# Altium schematic sheet CAN.SchDoc
size A; SheetNumber: 7; SheetTotal: 8
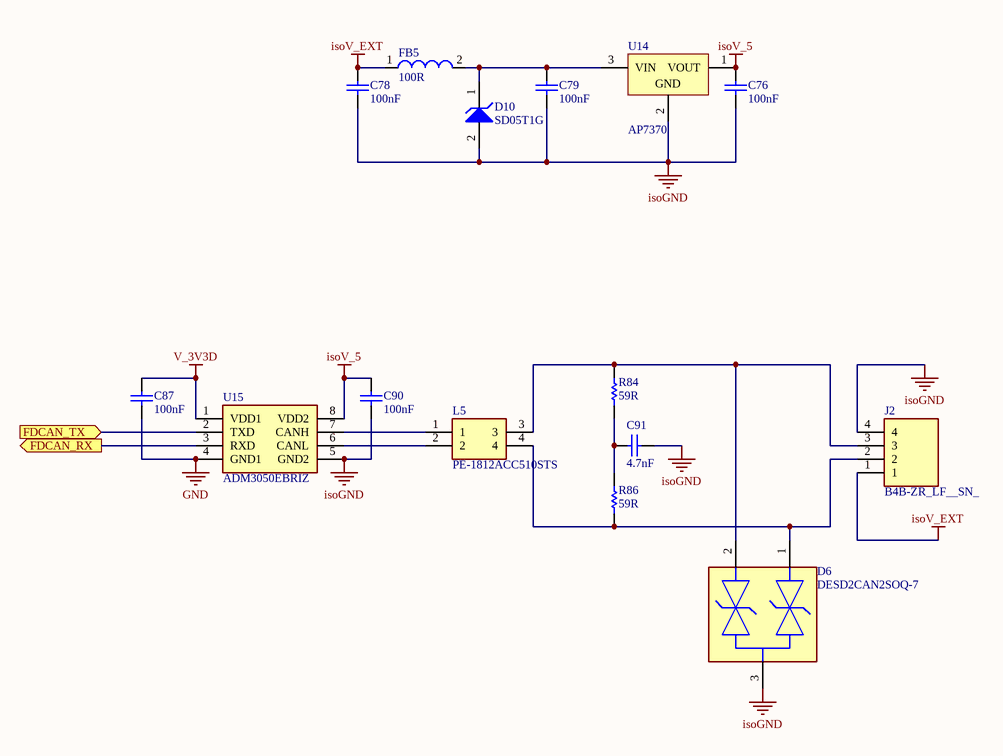
[diagram p0: CAN.SchDoc]

## Parts
C76  100nF  [CAPC1608X90X35NL10T15]
C78  100nF  [CAPC1608X90X35NL10T15]
C79  100nF  [CAPC1608X90X35NL10T15]
C87  100nF  [CAPC1608X90X35NL10T15]
C90  100nF  [CAPC1608X90X35NL10T15]
C91  4.7nF  [CAPC1608X90X35ML10T15]
D6  DESD2CAN2SOQ-7  [FP-SOT23-MFG]
D10  SD05T1G  [ONSC-SOD-323-2-477-02_G_V]
FB5  100R  [SMD-0603]
J2  B4B-ZR_LF__SN_  [SHDR4W50P0X150_1X4_750X350X450P]
L5  PE-1812ACC510STS  [PE1812ACC510STS]
R84  59R  [RESC1608X55X30ML15T15]
R86  59R  [RESC1608X55X30ML15T15]
U14  AP7370  [SOT-89_L]
U15  ADM3050EBRIZ  [SOIC127P1031X265-8N]

## Ports
FDCAN_RX (out), FDCAN_TX (in)

## Nets
GND: C87.1 U15.4(GND1)
isoGND: C76.1 C78.1 C79.1 C90.1 C91.2 D6.3 D10.2(A) J2.4 U14.2(GND) U15.5(GND2)
isoV_5: C76.2 C90.2 U14.1(VOUT) U15.8(VDD2)
isoV_EXT: C78.2 FB5.1 J2.1
V_3V3D: C87.2 U15.1(VDD1)
FDCAN_RX: U15.3(RXD) ; port FDCAN_RX
FDCAN_TX: U15.2(TXD) ; port FDCAN_TX
NetC79_2: C79.2 D10.1(K) FB5.2 U14.3(VIN)
NetC91_1: C91.1 R84.1 R86.2
NetD6_1: D6.1 J2.2 L5.4 R86.1
NetD6_2: D6.2 J2.3 L5.3 R84.2
NetL5_1: L5.1 U15.7(CANH)
NetL5_2: L5.2 U15.6(CANL)

## Library data of the parts
C76 C78 C79 C87 C90 = CAP: X7R 100nF ±10% 50V 0603 Multilayer Ceramic Capacitors MLCC - SMD/SMT ROHS; Part Number: GCM188R72A104KA64D; Manufacturer: Murata; Manufacturer Part Number: CC0603KRX7R9BB104; Voltage Rating: 100V; Supplier 1: Arrow Electronics; Supplier Part Number 1: GCM188R72A104KA64D; RoHS: Yes; Category: Ceramic Capacitors; Mount: Surface Mount; Case/Package: 0603; Case Code (Imperial): 0603; Case Code (Metric): 1608; Min Operating Temperature: -55°C; Max Operating Temperature: 125°C; Tolerance: 10%; Packaging: Tape and Reel; Capacitance: 100nF; Dielectric: X7R; Termination: SMD/SMT; Voltage Rating (DC): 100V; Length: 1.6mm; Height: 0.8mm; Depth: 0.8mm; Radiation Hardening: No; ComponentLink1URL: https://datasheet.ciiva.com/17451/product-17451047.pdf?src-supplier=Avnet+Europe; ComponentLink1Description: https://datasheet.ciiva.com/17451/product-17451047.pdf?src-supplier=Avnet+Europe; ComponentLink2URL: https://datasheet.ciiva.com/26889/getdatasheetpartid-387765-26889164.pdf?src-supplier=Verical; ComponentLink2Description: https://datasheet.ciiva.com/26889/getdatasheetpartid-387765-26889164.pdf?src-supplier=Verical; Parameter 1: *; JLCPCB Part #: C14663
C91 = CMP-2006-02924-1: X7R ±10% 4.7nF 50V 0603 Multilayer Ceramic Capacitors MLCC - SMD/SMT ROHS; Part Number: GRM188R71H472KA01D; Manufacturer: Murata; Insulation Resistance: 10GR; Supplier 1: Farnell; Supplier Part Number 1: 1118177; Manufacturer Part Number: GRM188R71H472KA01D; RoHS: Yes; Category: Ceramic Capacitors; Pricing 1: 1=19.92000, 3=19.13000 (GBP); Mount: Surface Mount; Case/Package: 0603; Number of Pins: 2; Case Code (Imperial): 0603; Case Code (Metric): 1608; Dielectric Material: Ceramic; Material: Ceramic; Min Operating Temperature: -55°C; Max Operating Temperature: 125°C; Capacitance: 4.7nF; Voltage Rating (DC): 50V; Tolerance: 10%; Packaging: Tape and Reel; Dielectric: X7R; Series: GRM; Voltage Rating: 50V; Package Quantity: 1; Termination: SMD/SMT; Voltage: 50V; Length: 1.6mm; Width: 0.8mm; Height: 0.8mm; Depth: 0.8mm; Thickness: 0.035inch; Radiation Hardening: No; RoHS Compliant: Yes; REACH SVHC: No SVHC; Lead Free: Lead Free; ComponentLink1URL: https://datasheet.ciiva.com/5412/product-5412608.pdf?src-supplier=Mouser; ComponentLink1Description: https://datasheet.ciiva.com/5412/product-5412608.pdf?src-supplier=Mouser; ComponentLink2URL: https://datasheet.ciiva.com/18102/getdatasheetpartid-75298-18102657.pdf?src-supplier=Verical; ComponentLink2Description: https://datasheet.ciiva.com/18102/getdatasheetpartid-75298-18102657.pdf?src-supplier=Verical; ComponentLink3URL: https://datasheet.ciiva.com/11787/0900766b8003061f-11787116.pdf?src-supplier=RSComponents; ComponentLink3Description: https://datasheet.ciiva.com/11787/0900766b8003061f-11787116.pdf?src-supplier=RSComponents; ComponentLink4URL: https://datasheet.ciiva.com/29201/451888-da-01-en-vs-kondensator-0603-29201828.pdf?src-supplier=Conrad; ComponentLink4Description: https://datasheet.ciiva.com/29201/451888-da-01-en-vs-kondensator-0603-29201828.pdf?src-supplier=Conrad; ComponentLink5URL: https://datasheet.ciiva.com/7937/4360-7937669.pdf?src-supplier=Element14; ComponentLink5Description: https://datasheet.ciiva.com/7937/4360-7937669.pdf?src-supplier=Element14; ComponentLink6URL: https://datasheet.ciiva.com/48428/nmgrm-data-en-48428597.pdf?src-supplier=Distrelec; ComponentLink6Description: https://datasheet.ciiva.com/48428/nmgrm-data-en-48428597.pdf?src-supplier=Distrelec; ComponentLink7URL: https://datasheet.ciiva.com/7937/4360-7937670.pdf?src-supplier=Element14; ComponentLink7Description: https://datasheet.ciiva.com/7937/4360-7937670.pdf?src-supplier=Element14; ComponentLink8URL: https://datasheet.ciiva.com/7937/4360-7937671.pdf?src-supplier=Element14; ComponentLink8Description: https://datasheet.ciiva.com/7937/4360-7937671.pdf?src-supplier=Element14; ComponentLink9URL: https://datasheet.ciiva.com/130/partnumbering-e-01-130733.pdf?src-supplier=Digi-Key; ComponentLink9Description: https://datasheet.ciiva.com/130/partnumbering-e-01-130733.pdf?src-supplier=Digi-Key; ComponentLink10URL: https://datasheet.ciiva.com/130/partnumbering-e-01-130734.pdf?src-supplier=Digi-Key; ComponentLink10Description: https://datasheet.ciiva.com/130/partnumbering-e-01-130734.pdf?src-supplier=Digi-Key; ComponentLink11URL: https://datasheet.ciiva.com/130/partnumbering-e-01-130735.pdf?src-supplier=Digi-Key; ComponentLink11Description: https://datasheet.ciiva.com/130/partnumbering-e-01-130735.pdf?src-supplier=Digi-Key; Parameter 1: *; JLCPCB Part #: C53987
D6 = CMP-12828-000016-1: TVS DIODE 24V 41V SOT23; Manufacturer: Diodes Inc.; Peak Pulse Current: 5A; Automotive Grade: Grade 0; Value: 25pF; Number Of Channels: 2; Direction: Bidirectional; Max Junction Temp: +150°C; Breakdown Voltage: 25.4V; Peak Pulse Power: 230W; Standoff Height: 0.013mm; ComponentLink2Description: Datasheet; Temperature Range High: +150°C; Device Class L2: TVS Diodes; Octopart: https://octopart.com/desd2can2soq-7-diodes+inc.-53081564; Device Class L3: unset; RoHS: TRUE; ComponentLink2URL: https://www.diodes.com/assets/Datasheets/DESD2CAN2SOQ.pdf; Height: 1.1mm; Digikey Description: TVS DIODE 24V 41V SOT23; Footprint Url: https://www.diodes.com/assets/Package-Files/SOT23.pdf; Manufacturer Part Number: DESD2CAN2SOQ-7; Package: SOT23; Temperature: -65°C to +150°C; Mouser Description: ESD Suppressors / TVS Diodes Dual CAN Bus ESD 25pF 24V 25.4V; Capacitance: 25pF; Category: Diode; Clamping Voltage: 41V; Lead Free: Yes; Reverse Standoff Voltage: 24V; Device Class L1: Circuit Protection; Temperature Range Low: -65°C; Automotive: Yes; Parameter 1: *; JLCPCB Part #: *
D10 = CMP-1061-00629-1: Transient Voltage Suppressor Diode, for ESD Protection, 2-Pin SOD-323, Pb-Free, Tape and Reel; Manufacturer: On Semiconductor; PPK Max (W): 350; IR Max (uA): 10; Direction: Unidirectional; ComponentLink1Description: Manufacturer URL; PackageReference: SOD-323-2-477-02_G; Mounting Technology: Surface Mount; PackageVersion: Rev. G, 02/2005; ComponentLink2URL: http://www.onsemi.com/pub_link/Collateral/SD05T1-D.PDF; PackageDescription: 2-Pin SOD, Body 1.7 x 1.25 mm; Packing: Tape and Reel; ComponentLink2Description: Datasheet; ComponentLink1URL: http://www.onsemi.com/; ComponentLink3Description: Package Specification; ComponentLink3URL: http://www.onsemi.com/pub_link/Collateral/SD05T1-D.PDF; PartNumber: SD05T1G; RoHS: Pb-Free; DatasheetVersion: Rev. 2; Parameter 1: *; JLCPCB Part #: *
FB5 = CMP-0220-00115-1: SMD EMI Suppression Ferrite Bead WE-CBF, Z = 1500 Ohm; DatasheetVersion: Dec-2005; ComponentLink1URL: http://www.we-online.com; PackageVersion: 2009; PackageDescription: Chip Inductor, 2-Leads, Body 1.6 x 0.8 mm; ComponentLink2URL: http://www.we-online.de/katalog/media/pdf/742792691.pdf; ComponentLink1Description: Manufacturer Link; ComponentLink2Description: Datasheet; Impedance: 1500 Ohm; PackageReference: SMD-0603; Parameter 1: *; JLCPCB Part #: *
J2 = B4B-ZR_LF__SN_: Connector; Manufacturer_Name: JST (JAPAN SOLDERLESS TERMINALS); Manufacturer_Part_Number: B4B-ZR(LF)(SN); Datasheet Link: http://docs-emea.rs-online.com/webdocs/1147/0900766b81147f94.pdf; Height: 4.5mm; Arrow Part Number: B4B-ZR(LF)(SN); Arrow Price/Stock: https://www.arrow.com/en/products/b4b-zr-lf-sn/jst-manufacturing; Parameter 1: *; JLCPCB Part #: *
L5 = PE-1812ACC510STS: Inductor; Manufacturer_Name: Pulse; Datasheet Link: https://productfinder.pulseeng.com/doc_type/WEB301/doc_num/W717/doc_part/W717.pdf; Height: 3mm; Manufacturer_Part_Number: PE-1812ACC510STS; Mouser Part Number: 673-PE-1812ACC510STS; Mouser Price/Stock: https://www.mouser.co.uk/ProductDetail/Pulse-Electronics/PE-1812ACC510STS?qs=ar8LaIfZsbGrh9tcPYNGNA%3D%3D; Arrow Part Number: PE-1812ACC510STS; Arrow Price/Stock: https://www.arrow.com/en/products/pe-1812acc510sts/pulse-electronics-corporation; Parameter 1: *; JLCPCB Part #: *
R84 R86 = CMP-2000-00583-1: Manufacturer: Panasonic; Part Number: ERJ-3EKF59R0V; Power Rating: 100mW; Tolerance: 1%; Temperature Coefficient: 100ppm/°C; Voltage Rating: 75V; Voltage Rating (DC): 50V; Supplier 1: Digi-Key; Supplier Part Number 1: P59.0HCT-ND; Manufacturer Part Number: ERJ-3EKF59R0V; RoHS: Yes; Category: Chip SMD Resistors; Stock 1: 12961; Pricing 1: 1=0.10000, 10=0.03700, 100=0.01490, 1000=0.00670, 2500=0.00582 (USD); Mount: Surface Mount; Case/Package: 0603; Case Code (Metric): 1608; Case Code (Imperial): 0603; Contact Plating: Tin; Min Operating Temperature: -55°C; Max Operating Temperature: 155°C; Resistance: 59R; Packaging: Tape and Reel; Resistor Type: Thick Film; Number of Terminations: 2; Package Quantity: 1; Max Power Dissipation: 100mW; Series: ERJ; Termination: SMD/SMT; Resistance Tolerance: 1%; Features: Automotive AEC-Q200; Technology: THICK FILM; Construction: Rectangular; Length: 1.6mm; Width: 0.031inch; Height: 0.45mm; Depth: 0.8mm; RoHS Compliant: Yes; REACH SVHC: Yes; Lead Free: Contains Lead; Military Standard: Not; ComponentLink1URL: https://datasheet.ciiva.com/9188/aoa0000ce2-9188485.pdf?src-supplier=Avnet; ComponentLink1Description: https://datasheet.ciiva.com/9188/aoa0000ce2-9188485.pdf?src-supplier=Avnet; ComponentLink2URL: https://datasheet.ciiva.com/46420/1678782-46420341.pdf?src-supplier=Element14; ComponentLink2Description: https://datasheet.ciiva.com/46420/1678782-46420341.pdf?src-supplier=Element14; ComponentLink3URL: https://datasheet.ciiva.com/22729/1678782-22729158.pdf?src-supplier=Farnell; ComponentLink3Description: https://datasheet.ciiva.com/22729/1678782-22729158.pdf?src-supplier=Farnell; ComponentLink4URL: https://datasheet.ciiva.com/22673/1678782-22673800.pdf?src-supplier=Element14; ComponentLink4Description: https://datasheet.ciiva.com/22673/1678782-22673800.pdf?src-supplier=Element14; ComponentLink5URL: https://datasheet.ciiva.com/9188/aoa0000ce2-9188489.pdf?src-supplier=Avnet; ComponentLink5Description: https://datasheet.ciiva.com/9188/aoa0000ce2-9188489.pdf?src-supplier=Avnet; ComponentLink6URL: https://datasheet.ciiva.com/30242/aoa0000ce2-30242153.pdf?src-supplier=Onlinecomponents.com; ComponentLink6Description: https://datasheet.ciiva.com/30242/aoa0000ce2-30242153.pdf?src-supplier=Onlinecomponents.com; ComponentLink7URL: https://datasheet.ciiva.com/16777/70260748-16777979.pdf?src-supplier=Allied+Electronics; ComponentLink7Description: https://datasheet.ciiva.com/16777/70260748-16777979.pdf?src-supplier=Allied+Electronics; Parameter 1: *; JLCPCB Part #: *
U14 = CMP-0244-00401-1: Ultra Low Drop Voltage Regulators with Inhibit, Low ESR Output Capacitors Compatible, 3.3V, 3-Pin SOT-89, Tape and Reel; ComponentLink1Description: Manufacturer URL; ComponentLink2URL: http://www.st.com/internet/com/TECHNICAL_RESOURCES/TECHNICAL_LITERATURE/DATASHEET/CD00001635.pdf; PackageReference: SOT-89; DatasheetVersion: 14/07/2008; ComponentLink2Description: Datasheet; ComponentLink1URL: http://www.st.com; PackageDescription: 3-Pin SOT-89 Package 1.5 mm Pitch, 4.1 mm Lead Span; PackageVersion: 2011; Parameter 1: *; JLCPCB Part #: *
U15 = ADM3050EBRIZ: Integrated Circuit; Manufacturer_Name: Analog Devices; Datasheet Link: https://www.mouser.com/datasheet/2/609/ADM3050E-EP-1542022.pdf; Height: 2.65mm; Manufacturer_Part_Number: ADM3050EBRIZ; Mouser Part Number: 584-ADM3050EBRIZ; Mouser Price/Stock: https://www.mouser.co.uk/ProductDetail/Analog-Devices/ADM3050EBRIZ?qs=P1JMDcb91o7QWLbXtXYo%2Fw%3D%3D; Arrow Part Number: ADM3050EBRIZ; Arrow Price/Stock: https://www.arrow.com/en/products/adm3050ebriz/analog-devices?region=nac; Parameter 1: *; JLCPCB Part #: *